# Altium schematic sheet SCH-10-Power Connectors.SchDoc
size A4
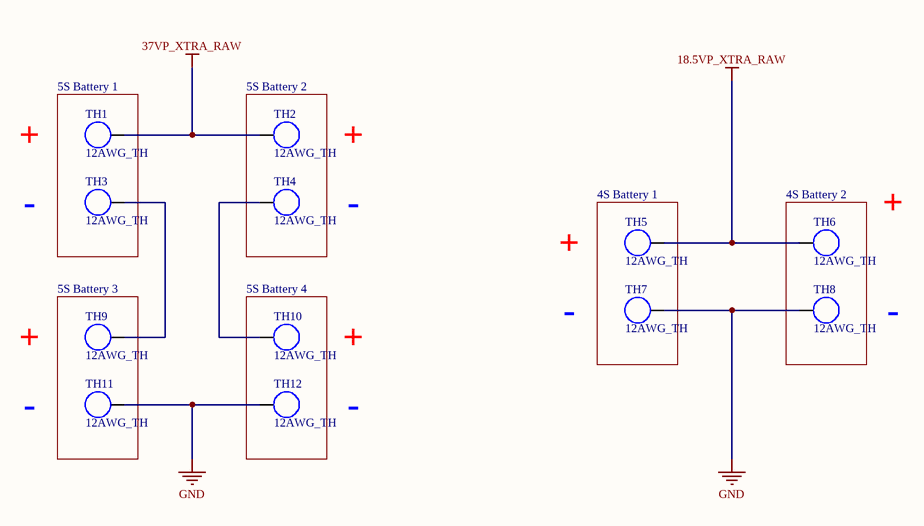
[diagram p0: SCH-10-Power Connectors.SchDoc]

## Parts
TH1  12AWG_TH  [12AWG_Wire_TH]
TH2  12AWG_TH  [12AWG_Wire_TH]
TH3  12AWG_TH  [12AWG_Wire_TH]
TH4  12AWG_TH  [12AWG_Wire_TH]
TH5  12AWG_TH  [12AWG_Wire_TH]
TH6  12AWG_TH  [12AWG_Wire_TH]
TH7  12AWG_TH  [12AWG_Wire_TH]
TH8  12AWG_TH  [12AWG_Wire_TH]
TH9  12AWG_TH  [12AWG_Wire_TH]
TH10  12AWG_TH  [12AWG_Wire_TH]
TH11  12AWG_TH  [12AWG_Wire_TH]
TH12  12AWG_TH  [12AWG_Wire_TH]

## Blocks framed on the sheet
5S Battery 1: TH1 TH3
5S Battery 2: TH2 TH4
4S Battery 1: TH5 TH7
4S Battery 2: TH6 TH8
5S Battery 3: TH9 TH11
5S Battery 4: TH10 TH12

## Nets
18.5VP_XTRA_RAW: TH5.1 TH6.1
37VP_XTRA_RAW: TH1.1 TH2.1
GND: TH7.1 TH8.1 TH11.1 TH12.1
NetTH3_1: TH3.1 TH9.1
NetTH4_1: TH4.1 TH10.1

## Notes on the sheet
- +
- -